# EasyEDA schematic SCH_NeoGeo_chip_adapter_board_2026-08-28.json
TITLE: SST39VF6401 to MX26L6420; REV: 1.0; Date: 2026-08-27; Sheet: 1/1; Drawn By: raphael.boichot; Company: Raphaël BOICHOT
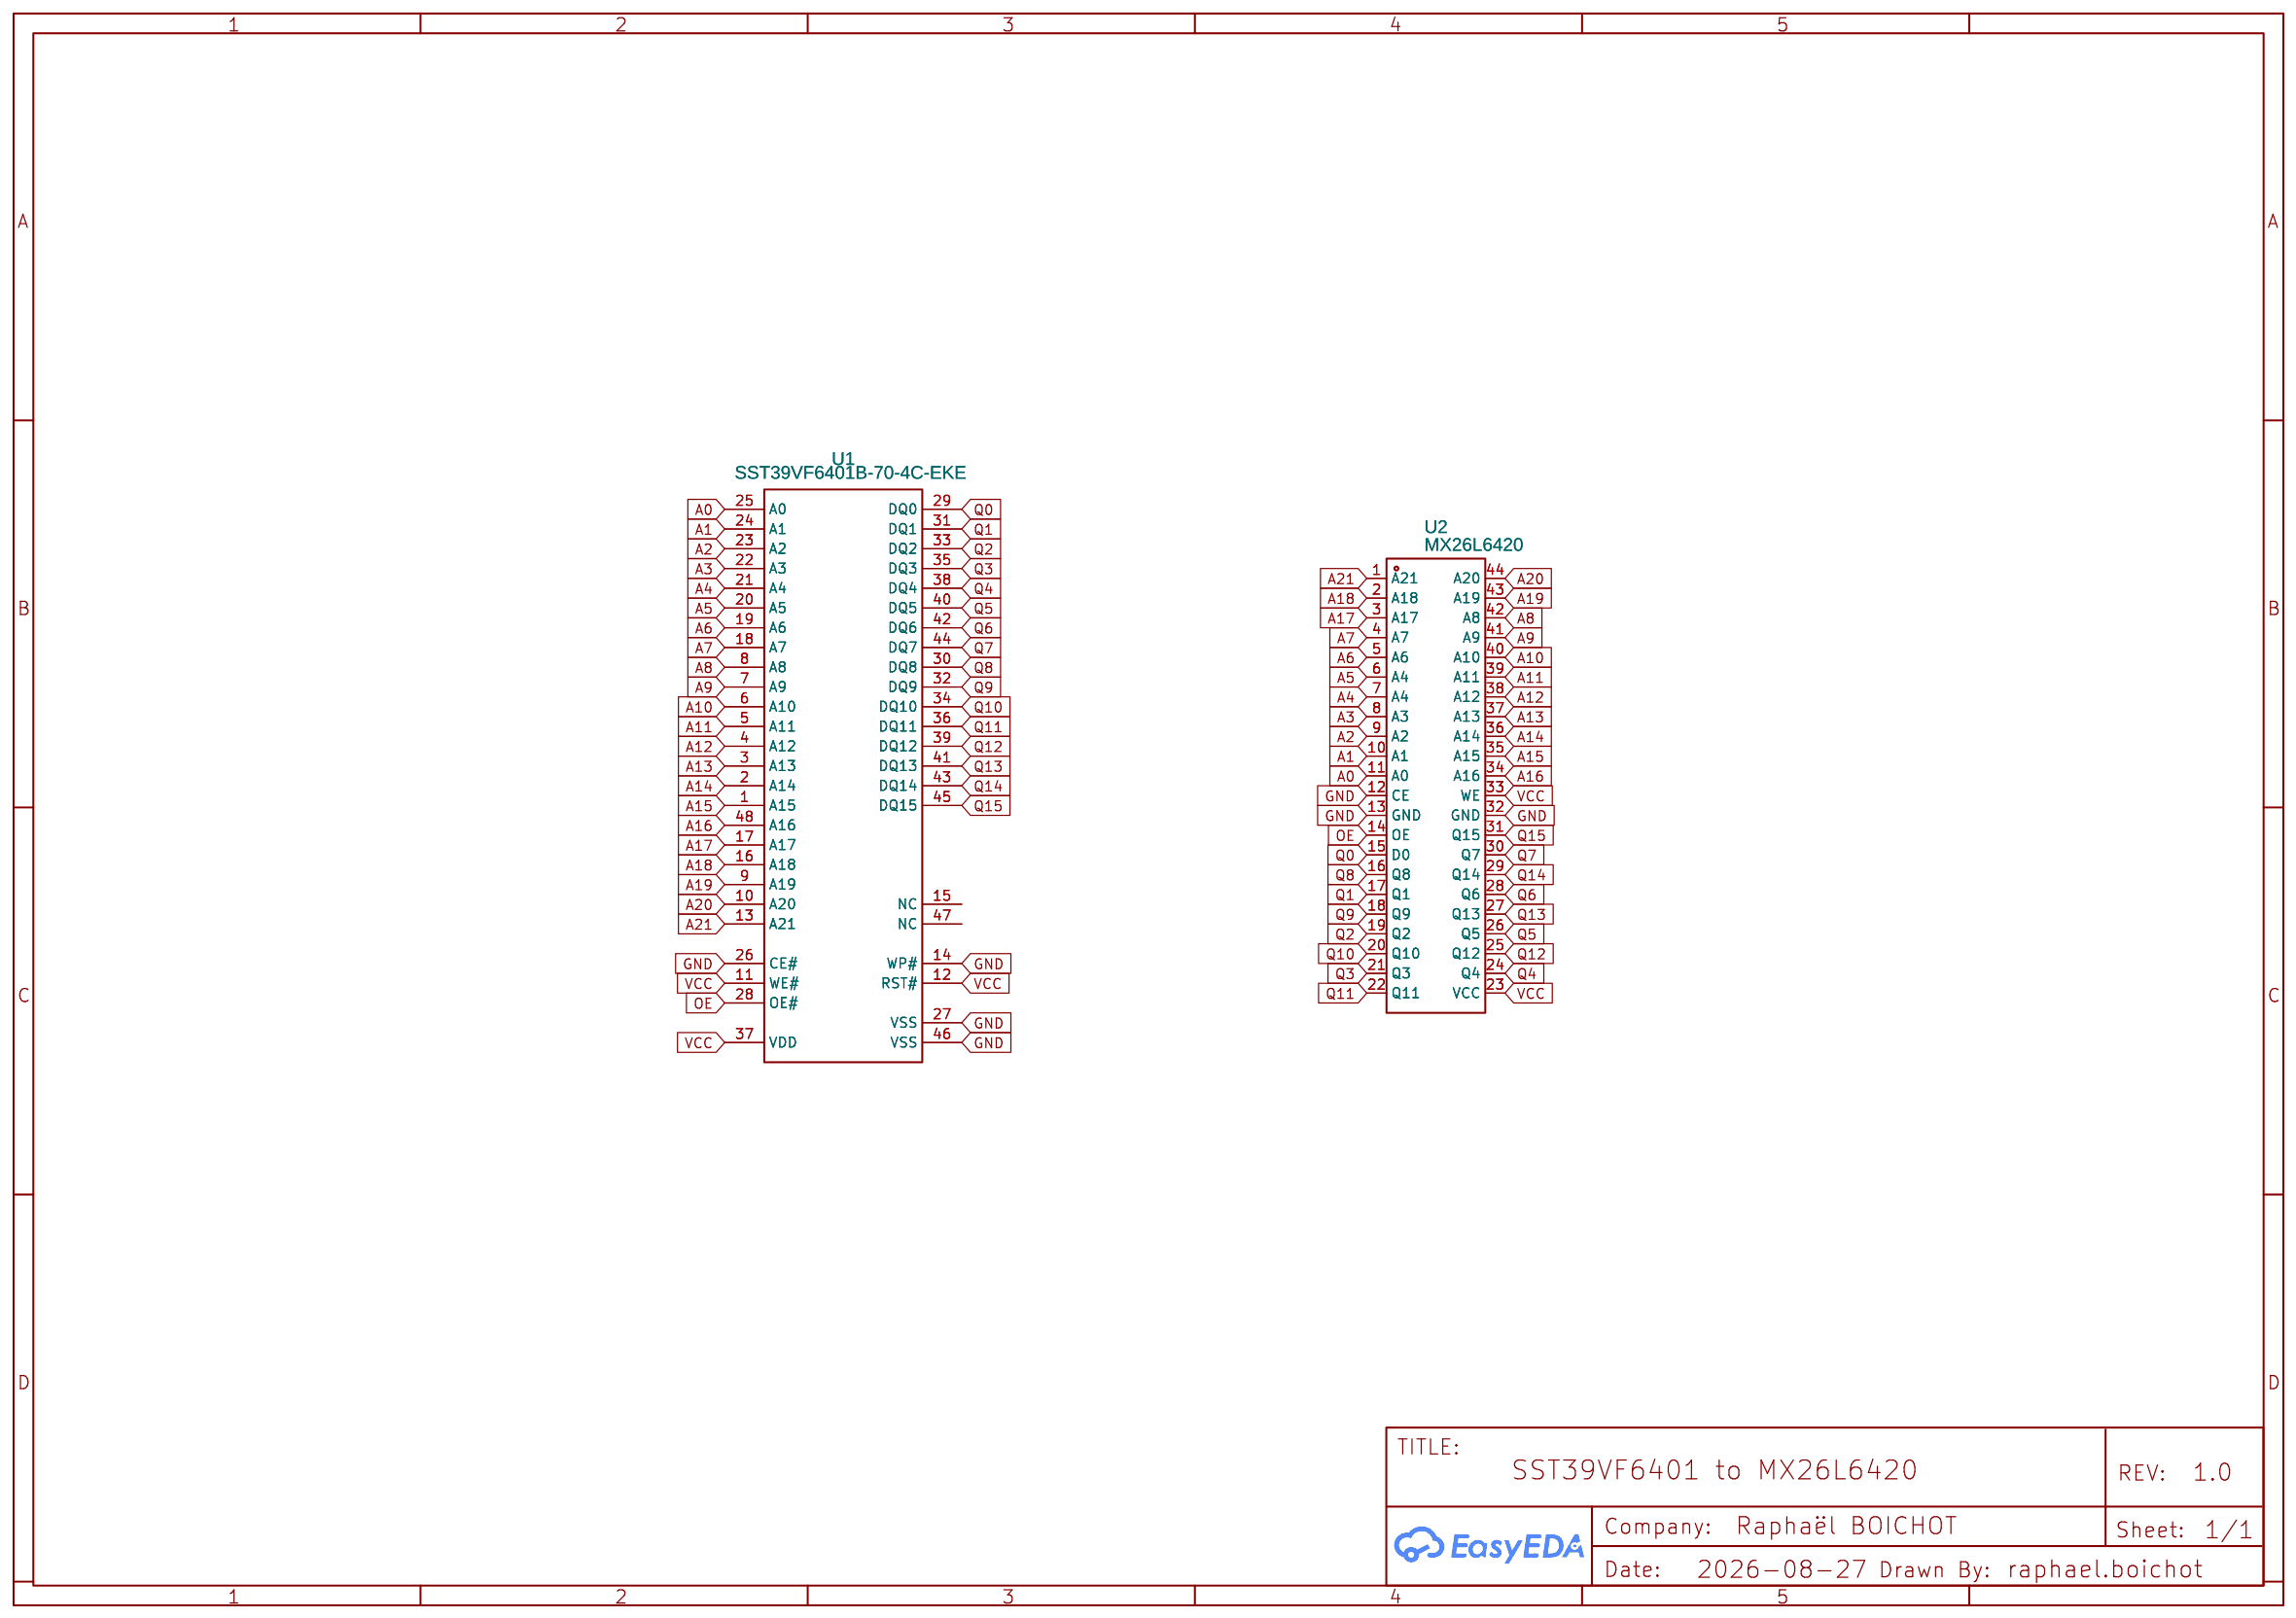
[diagram p0: schematic sheet]

## Parts
U1  SST39VF6401B-70-4C-EKE  [TSOP-48_L12.0-W18.4-P0.50-LS20.0-BL]
U2  MX26L6420  [29L3211]

## Library data of the parts
U1 = SST39VF6401B-70-4C-EKE: Supplier: LCSC; Manufacturer: MICROCHIP(美国微芯); Supplier Part: C11321; JLCPCB Part Class: Extended Part
U2 = MX26L6420: Manufacturer: Macronix; Contributor: ptchnk

## Nets
GND: U1.14(WP#) U1.26(CE#) U1.27(VSS) U1.46(VSS) U2.12(CE) U2.13(GND) U2.32(GND)
VCC: U1.11(WE#) U1.12(RST#) U1.37(VDD) U2.23(VCC) U2.33(WE)
A0: U1.25(A0) U2.11(A0)
A1: U1.24(A1) U2.10(A1)
A2: U1.23(A2) U2.9(A2)
A3: U1.22(A3) U2.8(A3)
A4: U1.21(A4) U2.7(A4)
A5: U1.20(A5) U2.6(A4)
A6: U1.19(A6) U2.5(A6)
A7: U1.18(A7) U2.4(A7)
A8: U1.8(A8) U2.42(A8)
A9: U1.7(A9) U2.41(A9)
A10: U1.6(A10) U2.40(A10)
A11: U1.5(A11) U2.39(A11)
A12: U1.4(A12) U2.38(A12)
A13: U1.3(A13) U2.37(A13)
A14: U1.2(A14) U2.36(A14)
A15: U1.1(A15) U2.35(A15)
A16: U1.48(A16) U2.34(A16)
A17: U1.17(A17) U2.3(A17)
A18: U1.16(A18) U2.2(A18)
A19: U1.9(A19) U2.43(A19)
A20: U1.10(A20) U2.44(A20)
A21: U1.13(A21) U2.1(A21)
OE: U1.28(OE#) U2.14(OE)
Q0: U1.29(DQ0) U2.15(D0)
Q1: U1.31(DQ1) U2.17(Q1)
Q2: U1.33(DQ2) U2.19(Q2)
Q3: U1.35(DQ3) U2.21(Q3)
Q4: U1.38(DQ4) U2.24(Q4)
Q5: U1.40(DQ5) U2.26(Q5)
Q6: U1.42(DQ6) U2.28(Q6)
Q7: U1.44(DQ7) U2.30(Q7)
Q8: U1.30(DQ8) U2.16(Q8)
Q9: U1.32(DQ9) U2.18(Q9)
Q10: U1.34(DQ10) U2.20(Q10)
Q11: U1.36(DQ11) U2.22(Q11)
Q12: U1.39(DQ12) U2.25(Q12)
Q13: U1.41(DQ13) U2.27(Q13)
Q14: U1.43(DQ14) U2.29(Q14)
Q15: U1.45(DQ15) U2.31(Q15)

Not connected (* = marked no-connect by the designer): U1 15(NC) 47(NC)
